# Altium schematic sheet Sheet2.SchDoc
size A4; SheetNumber: 2; SheetTotal: 2
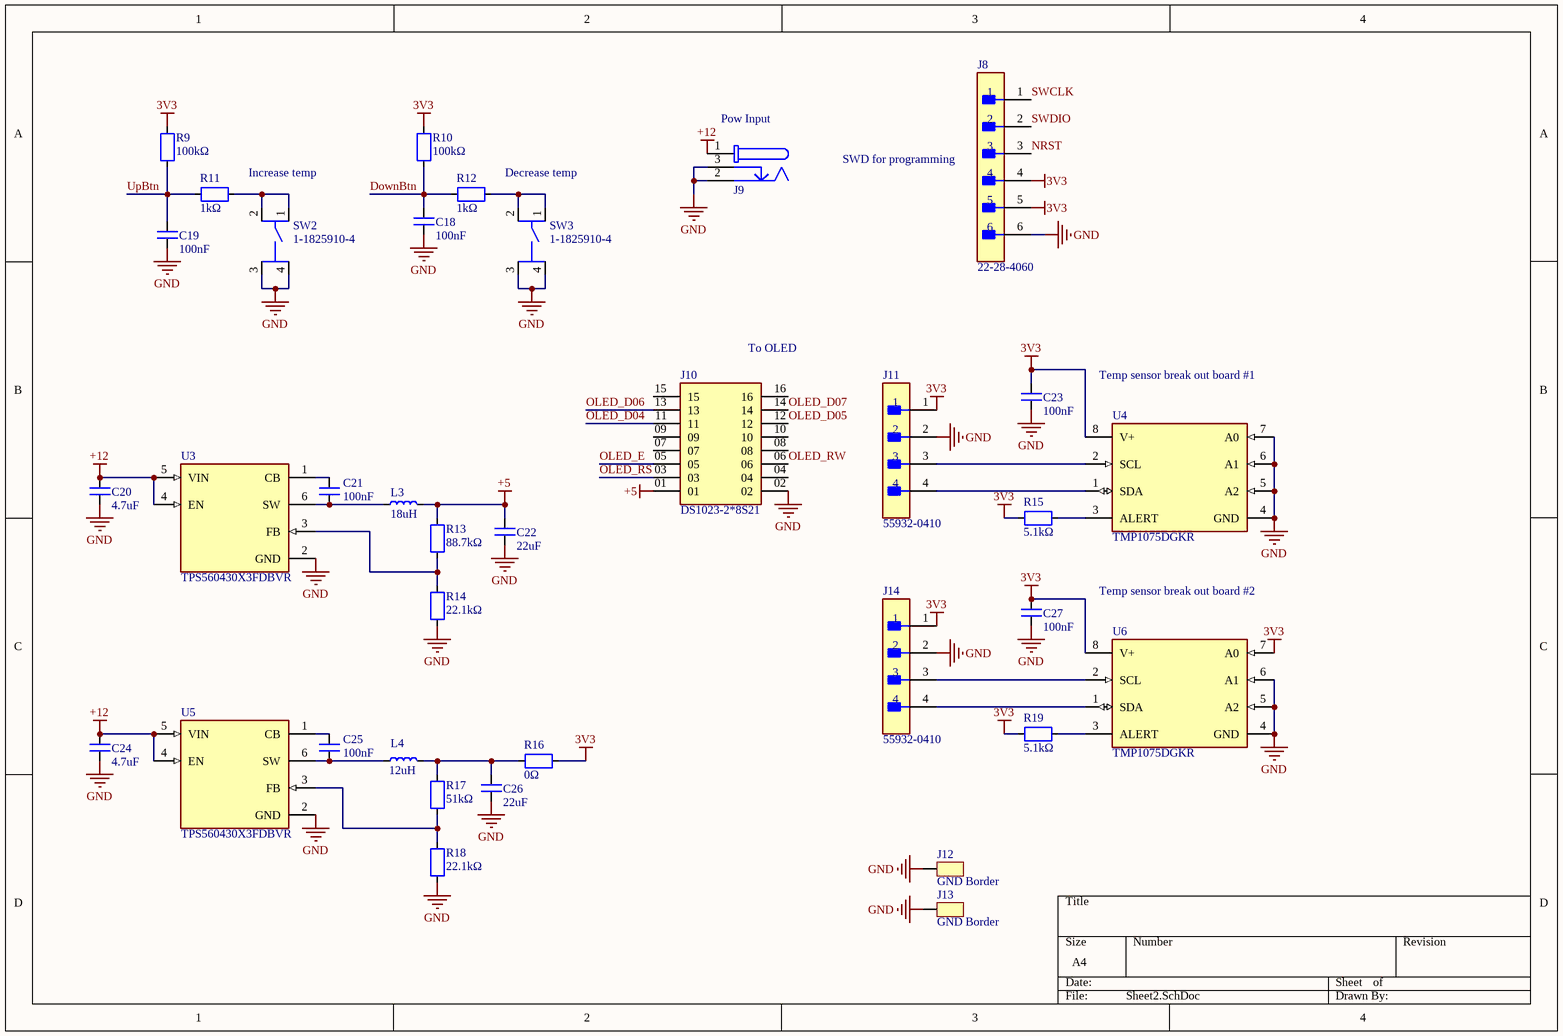
[diagram p0: Sheet2.SchDoc]

## Parts
C18  100nF  [0603 Imperial]
C19  100nF  [0603 Imperial]
C20  4.7uF  [0603 Imperial]
C21  100nF  [0603 Imperial]
C22  22uF  [0603 Imperial]
C23  100nF  [0603 Imperial]
C24  4.7uF  [0603 Imperial]
C25  100nF  [0603 Imperial]
C26  22uF  [0603 Imperial]
C27  100nF  [0603 Imperial]
J8  22-28-4060  [FP-22-28-4060-MFG]
J9  694106105102  [694108105102]  (value not drawn)
J10  DS1023-2*8S21  [16 pin header]
J11  55932-0410  [Wire Solder Pads]
J12  GND Border  [GND Border]
J13  GND Border  [GND Border]
J14  55932-0410  [Wire Solder Pads]
L3  18uH  [IND_SRR6038-180Y]
L4  12uH  [WE-PD2SR_7850]
R9  100kΩ  [0603 Imperial]
R10  100kΩ  [0603 Imperial]
R11  1kΩ  [0603 Imperial]
R12  1kΩ  [0603 Imperial]
R13  88.7kΩ  [0603 Imperial]
R14  22.1kΩ  [0603 Imperial]
R15  5.1kΩ  [0603 Imperial]
R16  0Ω  [0603 Imperial]
R17  51kΩ  [0603 Imperial]
R18  22.1kΩ  [0603 Imperial]
R19  5.1kΩ  [0603 Imperial]
SW2  1-1825910-4  [TE_1-1825910-4]
SW3  1-1825910-4  [TE_1-1825910-4]
U3  TPS560430X3FDBVR  [Buck]
U4  TMP1075DGKR  [FP-DGK0008A-IPC_A]
U5  TPS560430X3FDBVR  [Buck]
U6  TMP1075DGKR  [FP-DGK0008A-IPC_A]

## Nets
3V3: C23.2 C27.2 J8.4 J8.5 J11.1 J14.1 R9.2 R10.2 R15.2 R16.2 R19.2 U4.8(V+) U6.7(A0) U6.8(V+)
+5: C22.1 J10.01 L3.2 R13.2
+12: C20.1 C24.1 J9.1 U3.4(EN) U3.5(VIN) U5.4(EN) U5.5(VIN)
GND: C18.2 C19.2 C20.2 C22.2 C23.1 C24.2 C26.2 C27.1 J8.6 J9.2 J9.3 J10.02 J11.2 J12.0 J13.0 J14.2 R14.1 R18.1 SW2.3 SW2.4 SW3.3 SW3.4 U3.2(GND) U4.4(GND) U4.5(A2) U4.6(A1) U4.7(A0) U5.2(GND) U6.4(GND) U6.5(A2) U6.6(A1)
DownBtn: C18.1 R10.1 R12.2
NRST: J8.3
OLED_D04: J10.11
OLED_D05: J10.12
OLED_D06: J10.13
OLED_D07: J10.14
OLED_E: J10.05
OLED_RS: J10.03
OLED_RW: J10.06
SWCLK: J8.1
SWDIO: J8.2
UpBtn: C19.1 R9.1 R11.2
NetC21_1: C21.1 U3.1(CB)
NetC21_2: C21.2 L3.1 U3.6(SW)
NetC25_1: C25.1 U5.1(CB)
NetC25_2: C25.2 L4.1 U5.6(SW)
NetC26_1: C26.1 L4.2 R16.1 R17.2
NetJ11_3: J11.3 U4.2(SCL)
NetJ11_4: J11.4 U4.1(SDA)
NetJ14_3: J14.3 U6.2(SCL)
NetJ14_4: J14.4 U6.1(SDA)
NetR11_1: R11.1 SW2.1 SW2.2
NetR12_1: R12.1 SW3.1 SW3.2
NetR13_1: R13.1 R14.2 U3.3(FB)
NetR15_1: R15.1 U4.3(ALERT)
NetR17_1: R17.1 R18.2 U5.3(FB)
NetR19_1: R19.1 U6.3(ALERT)

Not connected (* = marked no-connect by the designer): J10 04 07 08 09 10 15 16

## Notes on the sheet
- Increase temp
- Decrease temp
- (near J9) Pow Input
- (near J8) SWD for programming
- (near J10) To OLED
- Temp sensor break out board #1
- Temp sensor break out board #2

## Library data of the parts
C18-C27 = 0603 C
J8 = 6 pin header: CONN HEADER VERT 6POS 2.54MM; Voltage Rating: 250V; Current Rating: 4A; Number of Contacts: 6; Max Voltage Rating (DC): 250.25kV; Gender: Male; Contact Resistance: 20mR; Connector Type: Male Pin; Color: Black; Max Voltage Rating (AC): 250V; Pitch: 2.54mm; Orientation: Straight; Max Operating Temperature: 75°C; Contact Plating: Tin; Depth: 2.49mm; Contact Type: Male Pin; Number of Positions: 6; Length: 15.24mm; Packaging: Bulk; Mount: Through Hole; Housing Material: Thermoplastic; Housing Color: Black; Termination: Solder; Contact Material: Brass; Min Operating Temperature: 0°C; Series: KK® 42375; Number of Rows: 1; Package Quantity: 1; RoHS Compliant: Yes; Contact Mating Length: 0.24inch
J9 = 694106105102: WR-DC DC Power Jack Connector, Male, Right Angled, 24V, 5A; Manufacturer: Wurth Elektronik; Opening Diameter: 6.4mm; Plug Inner Diameter: 2.05mm; Plug Outer Diameter: 5.5mm; ComponentLink1Description: Website Link; ComponentLink1URL: https://www.we-online.com/redexpert/article/694106105102?ad; ComponentLink2Description: Datasheet Link; ComponentLink2URL: https://www.we-online.com/redexpert/spec/694106105102?ad; Manufacturer Part Number: 694106105102; Category: DC Power Jack Connector; Match Code: WR-DC; Mount: Surface Mount; Operating Temperature Max: 85°C; Operating Temperature Min: -40°C; Packaging: Tape and Reel; Gender: Male; Orientation: Right Angled; Rated Current: 5A; Working Voltage: 24V
J10 = DS1023-2*8S21: SSQ - Samtec 2.54mm Square Tail Dual Row Socket Strip 8.5mm Profile - Fast Stock; MP: SSQ-108-XX-X-D; MF: Samtec; Package: None; Price: None; Value: *; Availability: Unavailable
J11 J14 = Wire Solder pads: CONN HEADER VERT 4POS 2MM; Number of Contacts: 4; Current Rating: 3A; Voltage Rating: 250V; Contact Plating: Tin; Series: 55932; Max Operating Temperature: 85°C; Contact Material: Brass; Case/Package: 0410; Min Operating Temperature: -25°C; Number of Positions: 4; Termination: Solder; Number of Circuits: 4; Orientation: Vertical; Pitch: 2mm; Radiation Hardening: No; Housing Material: Polyester; Number of Rows: 1; Contact Gender: Male; Packaging: Tray; RoHS Compliant: Yes; Mount: Through Hole
L3 = 18uH: Ind6.8x6.8x3.8mm,18uH30%1.5A,shdSMD | Bourns SRR6038-180Y; SnapEDA_Link: https://www.snapeda.com/parts/SRR6038-180Y/Bourns/view-part/?ref=snap; Package: NON STANDARD-2 Bourns; Value: *; MF: Bourns; MP: SRR6038-180Y; Check_prices: https://www.snapeda.com/parts/SRR6038-180Y/Bourns/view-part/?ref=eda
L4 = 12uH: WE-PD2SR SMT Power Inductor, size 7850, 1.2µH, 4.85A, 13mΩ; Manufacturer Part Number: 744787012; Manufacturer: Wurth Elektronik; Case/Size Code: 7850; DC Resistance: 8.5mΩ; Saturation Current: 6A; Self Resonant Frequency: 110MHz; Category: Shielded Power Inductors; Match Code: WE-PD2SR; ComponentLink1Description: Website Link; ComponentLink1URL: https://www.we-online.com/redexpert/article/744787012?ad; ComponentLink2Description: Datasheet Link; ComponentLink2URL: https://www.we-online.com/redexpert/spec/744787012?ad; Mount: Surface Mount; Operating Temperature Max: 125°C; Operating Temperature Min: -40°C; Packaging: Tape and Reel; Length: 7.8mm; Width: 7mm; Height: 5mm; DC Resistance Max: 13mΩ; Inductance: 1.2µH; Rated Current: 4.85A
R9-R19 = 0603 R
SW2 SW3 = 1-1825910-4: Switch Tactile OFF _ON_ SPST Round Button PC Pins 0.05A 24VDC 100000Cycles 1.56N Thru-Hole; MF: TE Connectivity; Availability: Unavailable; SnapEDA_Link: https://www.snapeda.com/parts/1-1825910-4/TE%20Connectivity%20ALCOSWITCH%20Switches/view-part/558688/?ref=snap; Price: None; EU_RoHS_Compliance: Compliant; Package: None; TE_purchase_URL: https://www.te.com/usa-en/product-1-1825910-4.html?te_bu=Cor&te_type=disp&te_campaign=seda_glo_cor-seda-global-disp-prtnr-fy19-seda-model-bom-cta_sma-317_1&elqCampaignId=32493; MP: 1-1825910-4; Value: *
U3 U5 = Buck: MF: {'manufacturer': u'Texas Instruments'}; Package: None; Price: None; Value: *; MP: TPS560430X3FDBVR; Availability: Unavailable
U4 U6 = CMP-04948-000063-1: SENSOR TEMPERATURE; Interface: I2C; RoHS Compliant: Yes; Min Operating Temperature: -40°C; Max Operating Temperature: 125°C